# Altium schematic sheet Converter_3V3.SchDoc
size A4; SheetNumber: 3; SheetTotal: 8
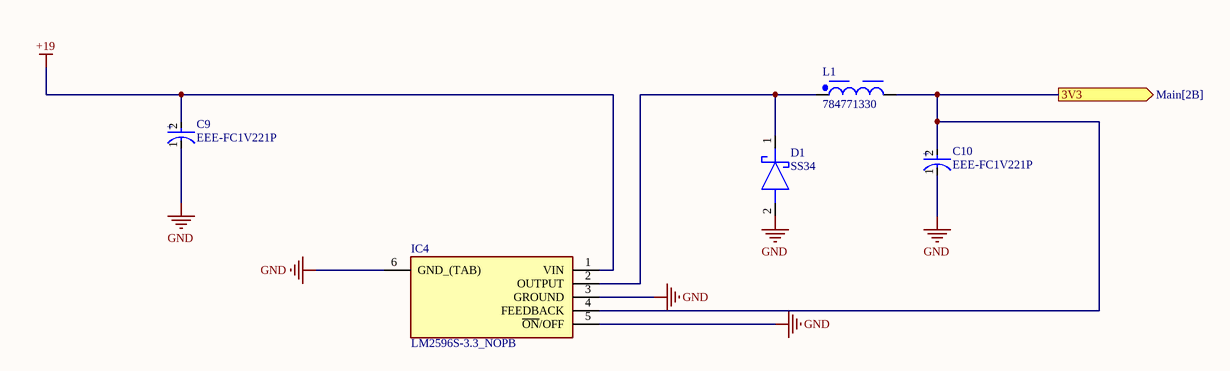
[diagram p0: Converter_3V3.SchDoc]

## Parts
C9  EEE-FC1V221P  [FP-FC-G-MFG]
C10  EEE-FC1V221P  [FP-FC-G-MFG]
D1  SS34  [DIOM8059X256N]
IC4  LM2596S-3.3_NOPB  [TO170P1435X465-6N]
L1  784771330  [WE-PDA_1260]

## Ports
3V3 (out, see Main[2B])

## Nets
+19: C9.2(A) IC4.1(VIN)
GND: C9.1(C) C10.1(C) D1.2(A) IC4.3(GROUND) IC4.5(~{ON}/OFF) IC4.6(GND_(TAB))
3V3: C10.2(A) IC4.4(FEEDBACK) L1.2 ; port 3V3
NetD1_1: D1.1(K) IC4.2(OUTPUT) L1.1

## Notes on the sheet
- (in symbol CMP-05427-002152-1) +

## Library data of the parts
C9 C10 = CMP-05427-002152-1: CAP ALUM 220UF 20% 35V SMD; Life (Hours): 1000Hour; Leakage Current: 3uA; Ripple Current (AC): 670mA; Material: Aluminium; Impedance: 150mR; Mount: Surface Mount; Construction: Cylindrical; Ratings: AEC-Q200; Radiation Hardening: No; Height: 10.2mm; Height - Seated (Max): 0.402inch; Termination: SMD/SMT; Tolerance: 20%; Packaging: Tape and Reel; Min Operating Temperature: -40°C; Voltage: 35V; Case/Package: Radial; Length: 10.5mm; Ripple Current: 670mA; Contact Plating: Tin; Width: 900um; Capacitance: 220uF; Voltage Rating (DC): 35V; Diameter: 10mm; Package Quantity: 500; Lead Free: Lead Free; Reach SVHC Compliant: Yes; Series: FC; Max Operating Temperature: 105°C; Voltage Rating: 35V; RoHS Compliant: Yes; ESR (Equivalent Series Resistance): 150mR
D1 = SS34: Schottky Diode; Manufacturer_Name: onsemi; Datasheet Link: https://www.onsemi.com/pub/Collateral/SS39-D.PDF; Height: 2.56mm; Manufacturer_Part_Number: SS34; Mouser Part Number: 512-SS34; Mouser Price/Stock: https://www.mouser.co.uk/ProductDetail/onsemi-Fairchild/SS34?qs=2ONuHmP%2FXzb3ub11UdFfdQ%3D%3D; Arrow Part Number: SS34; Arrow Price/Stock: https://www.arrow.com/en/products/ss34/on-semiconductor?utm_currency=USD&region=nac
IC4 = LM2596S-3.3_NOPB: Integrated Circuit; Manufacturer_Name: Texas Instruments; Manufacturer_Part_Number: LM2596S-3.3/NOPB; Datasheet Link: http://www.ti.com/lit/ds/symlink/lm2596.pdf; Height: 4.65mm; Mouser Part Number: 926-LM2596S-3.3/NOPB; Mouser Price/Stock: https://www.mouser.co.uk/ProductDetail/Texas-Instruments/LM2596S-3.3-NOPB?qs=X1J7HmVL2ZHsEwG9Q6doow%3D%3D; Arrow Part Number: LM2596S-3.3/NOPB; Arrow Price/Stock: https://www.arrow.com/en/products/lm2596s-3.3nopb/texas-instruments?utm_currency=USD&region=nac
L1 = CMP-03913-88972560-2: 784771330 Power Inductor, 33Uh, Shielded, 2.8A Rohs Compliant: Yes; DC Resistance (DCR): 52mΩ; Inductance: 33µH; Number of Pins: 2; RoHS: Compliant; Length: 12mm; Min Operating Temperature: -40°C; Max Operating Temperature: 125°C; Ambient Temperature Range High: 85°C; NexarPartId: 88972560; Current Rating: 2.8A; Ambient Temperature Range Low: -40°C; Width: 12mm; Height: 6mm